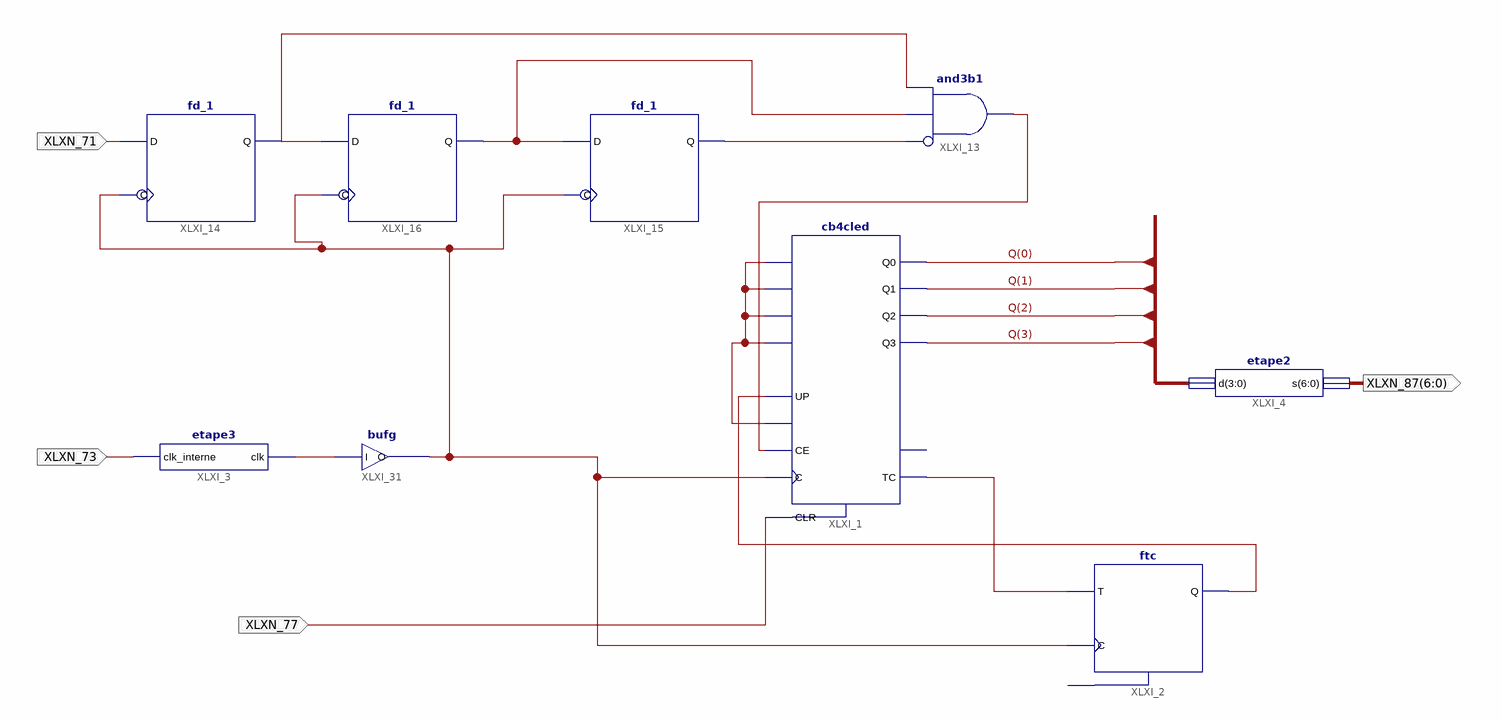
[diagram p0: schematic sheet 1]
// Xilinx ISE schematic SCHEMA4.sch (artix7) as structural Verilog: 9 symbols, 4 ports
module SCHEMA4 (
  input  XLXN_71,
  input  XLXN_73,
  input  XLXN_77,
  output [6:0] XLXN_87
);

  wire XLXN_2, XLXN_17, XLXN_67, XLXN_68, XLXN_69, XLXN_74, XLXN_81, XLXN_84, XLXN_85;
  wire [3:0] Q;

  etape3 XLXI_3 (.clk(XLXN_74), .clk_interne(XLXN_73));
  and XLXI_13 (XLXN_85, ~XLXN_68, XLXN_67, XLXN_69);  // and3b1
  fd_1 XLXI_14 (.C(XLXN_84), .D(XLXN_71), .Q(XLXN_69));
  fd_1 XLXI_15 (.C(XLXN_84), .D(XLXN_67), .Q(XLXN_68));
  fd_1 XLXI_16 (.C(XLXN_84), .D(XLXN_69), .Q(XLXN_67));
  etape2 XLXI_4 (.d(Q), .s(XLXN_87));
  ftc XLXI_2 (.C(XLXN_84), .T(XLXN_2), .Q(XLXN_17));  // open: CLR
  cb4cled XLXI_1 (
    .C(XLXN_84), .CE(XLXN_85), .CLR(XLXN_77), .D0(XLXN_81), .D1(XLXN_81), .D2(XLXN_81), .D3(XLXN_81),
    .L(XLXN_81), .UP(XLXN_17), .Q0(Q[0]), .Q1(Q[1]), .Q2(Q[2]), .Q3(Q[3]), .TC(XLXN_2));  // open: CEO
  bufg XLXI_31 (.I(XLXN_74), .O(XLXN_84));
endmodule
